# Altium schematic sheet PowerSupplies.SchDoc: Power Supplies
size A4; Author: João Guimarães; Organization: Altium Limited; Address1: L3, 12a Rodborough Rd; Address2: Frenchs Forest; Address3: NSW; Address4: Australia 2086; Revision: 2.0; SheetNumber: 2; SheetTotal: 9
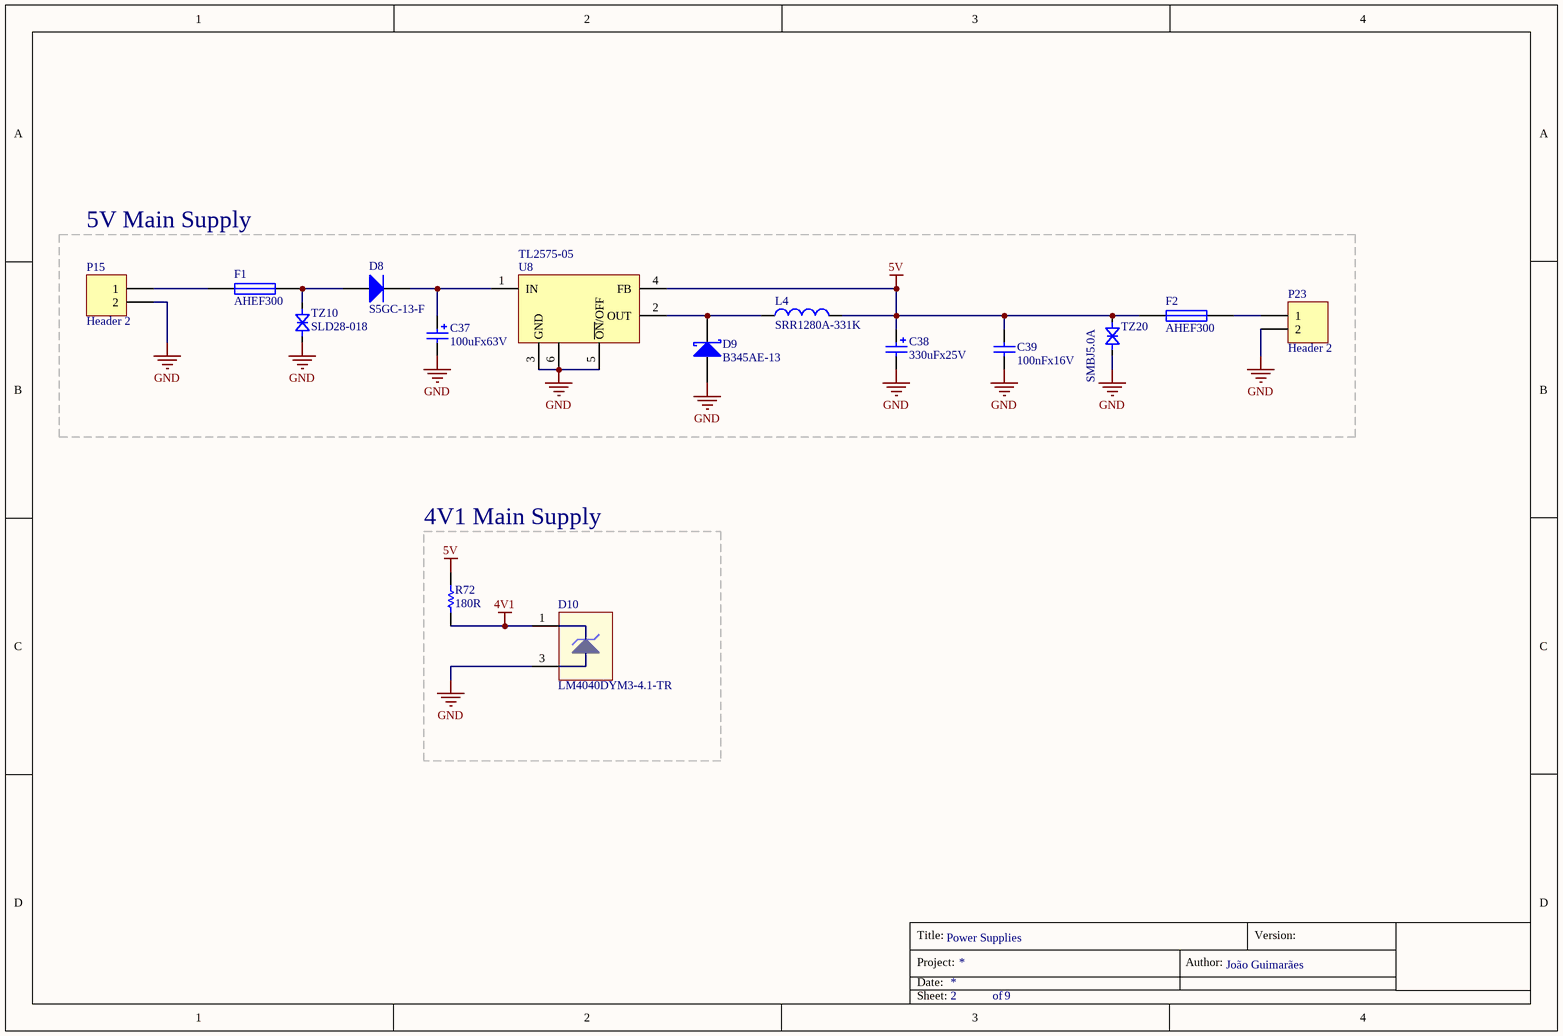
[diagram p0: PowerSupplies.SchDoc]

## Parts
C37  100uFx63V  [DISC-CAP-ALU-G]
C38  330uFx25V  [DISC-CAP-ALU-F]
C39  100nFx16V  [DISC-0805]
D8  S5GC-13-F  [DISC-DO214-AB]
D9  B345AE-13  [DISC-DO214-AC]
D10  LM4040DYM3-4.1-TR  [DISC-SOT-23]
F1  AHEF300  [DISC-PTC-0.2X0.4]
F2  AHEF300  [DISC-PTC-0.2X0.4]
L4  SRR1280A-331K  [DISC-IND-5050]
P15  Header 2  [CON-FLEXWIRE-1.5MM2-1X2]
P23  Header 2  [CON-FLEXWIRE-1.5MM2-1X2]
R72  180R  [DISC-0805]
TZ10  SLD28-018  [DISC-DIODE-0.9-V]
TZ20  SMBJ5.0A  [DISC-DO214-AA]
U8  TL2575-05  [CI-TO-263]

## Blocks framed on the sheet
5V Main Supply: C37-C39 D8 D9 F1 F2 L4 P15 P23 TZ10 TZ20 U8
4V1 Main Supply: D10 R72

## Nets
4V1: D10.1(A) R72.1
5V: C38.1 C39.2 F2.1 L4.2 R72.2 TZ20.2(K) U8.4(FB)
GND: C37.2 C38.2 C39.1 D9.1(A) D10.3(K) P15.2 P23.2 TZ10.1(A) TZ20.1(A) U8.3(GND) U8.5(~{ON}/OFF) U8.6(GND)
NetC37_1: C37.1 D8.2(K) U8.1(IN)
NetD8_1: D8.1(A) F1.2 TZ10.2(K)
NetD9_2: D9.2(K) L4.1 U8.2(OUT)
NetF1_1: F1.1 P15.1
NetF2_2: F2.2 P23.1

Not connected (* = marked no-connect by the designer): D10 2

## Notes on the sheet
- Title:
- Project:
- Date:
- Author:
- Version:
- Sheet:
- of

## Library data of the parts
C37 C38 = Cap Pol: Polarized Capacitor (Surface Mount)
C39 = Cap: Capacitor
D8 = Diode: Default Diode; Published: 8-Jun-2000; LatestRevisionDate: 17-Jul-2002; LatestRevisionNote: Re-released for DXP Platform.; PackageVersion: Sep-1996; PackageReference: SMC; Publisher: Altium Limited; PackageDescription: DO-214-AB/SMC; 2 C-Bend Leads; Body 7.9 x 5.9 mm, inc. leads (LxW); Code_JEDEC: DO-214-AB
D9 = D Schottky: Schottky Diode; Published: 8-Jun-2000; LatestRevisionDate: 17-Jul-2002; LatestRevisionNote: Re-released for DXP Platform.; PackageReference: SMB; Publisher: Altium Limited; PackageDescription: DO-214-AA/SMB; 2 C-Bend Leads; Body 5.3 x 3.6 mm, inc. leads (LxW); Code_JEDEC: DO-214-AA
D10 = LM4040: Shunt Voltage References
F1 F2 = Fuse 1: Fuse; Published: 8-Jun-2000; LatestRevisionDate: 17-Jul-2002; LatestRevisionNote: Re-released for DXP Platform.; PackageReference: PIN-W2/E2.8; Publisher: Altium Limited; PackageDescription: Thru-Hole; 2 Leads
L4 = Inductor: Chip Inductor
P15 P23 = Header 2: Header, 2-Pin; LatestRevisionDate: 17-Jul-2002; LatestRevisionNote: Re-released for DXP Platform.; Publisher: Altium Limited
R72 = Res: Resistor
TZ10 TZ20 = TVZ-Bi-Directional
U8 = TL2575-05IKTTR: Switching Voltage Regulators 1-A Step-Down Voltage